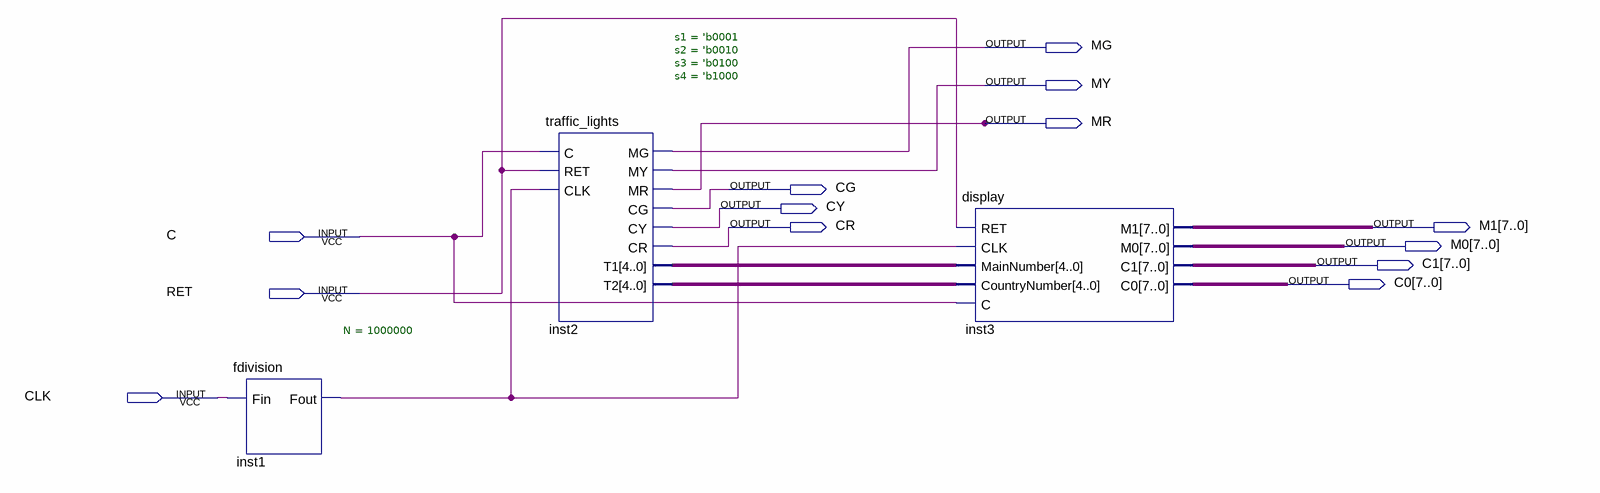
[diagram p0: schematic sheet]
// Quartus schematic jtd.bdf as structural Verilog: 3 symbols, 13 pins
module jtd (
  input  C,
  input  RET,
  input  CLK,
  output MG,
  output MY,
  output MR,
  output CG,
  output CY,
  output CR,
  output [7:0] M1,
  output [7:0] M0,
  output [7:0] C1,
  output [7:0] C0
);

  wire inst1_fout;
  wire [4:0] inst2_t1, inst2_t2;

  fdivision #(.N(1000000)) inst1 (.Fin(CLK), .Fout(inst1_fout));
  traffic_lights #(.s1('b0001), .s2('b0010), .s3('b0100), .s4('b1000)) inst2 (
    .C(C), .RET(RET), .CLK(inst1_fout), .MG(MG), .MY(MY), .MR(MR), .CG(CG), .CY(CY), .CR(CR), .T1(inst2_t1),
    .T2(inst2_t2));
  display inst3 (
    .RET(RET), .CLK(inst1_fout), .MainNumber(inst2_t1), .CountryNumber(inst2_t2), .C(C), .M1(M1), .M0(M0),
    .C1(C1), .C0(C0));
endmodule
